# EAGLE schematic Clock_Segment (EAGLE 7.5.0)
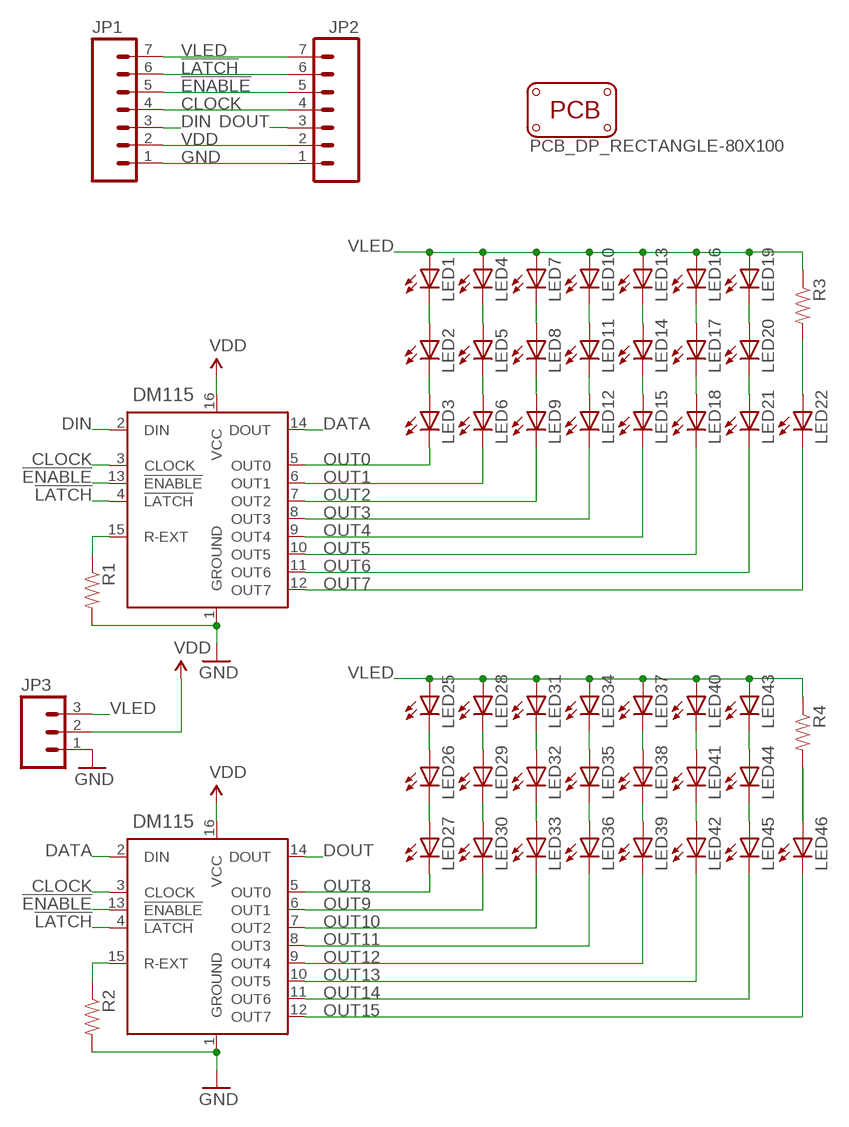
[diagram p0: schematic, sheet 1]

## Parts
JP1  M07  [1X07]
JP2  M07  [1X07]
JP3  M03SCREW  [SCREWTERMINAL-3.5MM-3]
LED1  LEDOVAL  [LED-OVAL]
LED2  LEDOVAL  [LED-OVAL]
LED3  LEDOVAL  [LED-OVAL]
LED4  LEDOVAL  [LED-OVAL]
LED5  LEDOVAL  [LED-OVAL]
LED6  LEDOVAL  [LED-OVAL]
LED7  LEDOVAL  [LED-OVAL]
LED8  LEDOVAL  [LED-OVAL]
LED9  LEDOVAL  [LED-OVAL]
LED10  LEDOVAL  [LED-OVAL]
LED11  LEDOVAL  [LED-OVAL]
LED12  LEDOVAL  [LED-OVAL]
LED13  LEDOVAL  [LED-OVAL]
LED14  LEDOVAL  [LED-OVAL]
LED15  LEDOVAL  [LED-OVAL]
LED16  LEDOVAL  [LED-OVAL]
LED17  LEDOVAL  [LED-OVAL]
LED18  LEDOVAL  [LED-OVAL]
LED19  LEDOVAL  [LED-OVAL]
LED20  LEDOVAL  [LED-OVAL]
LED21  LEDOVAL  [LED-OVAL]
LED22  LEDOVAL  [LED-OVAL]
LED25  LEDOVAL  [LED-OVAL]
LED26  LEDOVAL  [LED-OVAL]
LED27  LEDOVAL  [LED-OVAL]
LED28  LEDOVAL  [LED-OVAL]
LED29  LEDOVAL  [LED-OVAL]
LED30  LEDOVAL  [LED-OVAL]
LED31  LEDOVAL  [LED-OVAL]
LED32  LEDOVAL  [LED-OVAL]
LED33  LEDOVAL  [LED-OVAL]
LED34  LEDOVAL  [LED-OVAL]
LED35  LEDOVAL  [LED-OVAL]
LED36  LEDOVAL  [LED-OVAL]
LED37  LEDOVAL  [LED-OVAL]
LED38  LEDOVAL  [LED-OVAL]
LED39  LEDOVAL  [LED-OVAL]
LED40  LEDOVAL  [LED-OVAL]
LED41  LEDOVAL  [LED-OVAL]
LED42  LEDOVAL  [LED-OVAL]
LED43  LEDOVAL  [LED-OVAL]
LED44  LEDOVAL  [LED-OVAL]
LED45  LEDOVAL  [LED-OVAL]
LED46  LEDOVAL  [LED-OVAL]
PCB1  PCB_DP_RECTANGLE-80X100  [DP10080_V1]
R1  RESISTORAXIAL-0.3  [AXIAL-0.3]
R2  RESISTORAXIAL-0.3  [AXIAL-0.3]
R3  RESISTORAXIAL-0.3  [AXIAL-0.3]
R4  RESISTORAXIAL-0.3  [AXIAL-0.3]
U1  DM115DIP16  [DIL16]
U2  DM115DIP16  [DIL16]

## Nets
!ENABLE: JP1.5 JP2.5 U1.13(!ENABLE) U2.13(!ENABLE)
!LATCH: JP1.6 JP2.6 U1.4(!LATCH) U2.4(!LATCH)
CLOCK: JP1.4 JP2.4 U1.3(CLOCK) U2.3(CLOCK)
DATA: U1.14(DOUT) U2.2(DIN)
DIN: JP1.3 U1.2(DIN)
DOUT: JP2.3 U2.14(DOUT)
GND: JP1.1 JP2.1 JP3.1 R1.P$2 R2.P$2 U1.1(GROUND) U2.1(GROUND)
N$1: R1.P$1 U1.15(R-EXT)
N$2: LED1.CATHODE(C) LED2.ANODE(A)
N$3: LED2.CATHODE(C) LED3.ANODE(A)
N$4: LED4.CATHODE(C) LED5.ANODE(A)
N$5: LED5.CATHODE(C) LED6.ANODE(A)
N$6: LED7.CATHODE(C) LED8.ANODE(A)
N$7: LED8.CATHODE(C) LED9.ANODE(A)
N$8: LED10.CATHODE(C) LED11.ANODE(A)
N$9: LED11.CATHODE(C) LED12.ANODE(A)
N$10: LED13.CATHODE(C) LED14.ANODE(A)
N$11: LED14.CATHODE(C) LED15.ANODE(A)
N$12: LED16.CATHODE(C) LED17.ANODE(A)
N$13: LED17.CATHODE(C) LED18.ANODE(A)
N$14: LED19.CATHODE(C) LED20.ANODE(A)
N$15: LED20.CATHODE(C) LED21.ANODE(A)
N$16: LED46.ANODE(A) R4.P$2
N$18: R2.P$1 U2.15(R-EXT)
N$19: LED25.CATHODE(C) LED26.ANODE(A)
N$20: LED26.CATHODE(C) LED27.ANODE(A)
N$21: LED28.CATHODE(C) LED29.ANODE(A)
N$22: LED29.CATHODE(C) LED30.ANODE(A)
N$23: LED31.CATHODE(C) LED32.ANODE(A)
N$24: LED32.CATHODE(C) LED33.ANODE(A)
N$25: LED34.CATHODE(C) LED35.ANODE(A)
N$26: LED35.CATHODE(C) LED36.ANODE(A)
N$27: LED37.CATHODE(C) LED38.ANODE(A)
N$28: LED38.CATHODE(C) LED39.ANODE(A)
N$29: LED40.CATHODE(C) LED41.ANODE(A)
N$30: LED41.CATHODE(C) LED42.ANODE(A)
N$31: LED43.CATHODE(C) LED44.ANODE(A)
N$32: LED44.CATHODE(C) LED45.ANODE(A)
N$34: LED22.ANODE(A) R3.P$2
OUT0: LED3.CATHODE(C) U1.5(OUT0)
OUT1: LED6.CATHODE(C) U1.6(OUT1)
OUT2: LED9.CATHODE(C) U1.7(OUT2)
OUT3: LED12.CATHODE(C) U1.8(OUT3)
OUT4: LED15.CATHODE(C) U1.9(OUT4)
OUT5: LED18.CATHODE(C) U1.10(OUT5)
OUT6: LED21.CATHODE(C) U1.11(OUT6)
OUT7: LED22.CATHODE(C) U1.12(OUT7)
OUT8: LED27.CATHODE(C) U2.5(OUT0)
OUT9: LED30.CATHODE(C) U2.6(OUT1)
OUT10: LED33.CATHODE(C) U2.7(OUT2)
OUT11: LED36.CATHODE(C) U2.8(OUT3)
OUT12: LED39.CATHODE(C) U2.9(OUT4)
OUT13: LED42.CATHODE(C) U2.10(OUT5)
OUT14: LED45.CATHODE(C) U2.11(OUT6)
OUT15: LED46.CATHODE(C) U2.12(OUT7)
VDD: JP1.2 JP2.2 JP3.2 U1.16(VCC) U2.16(VCC)
VLED: JP1.7 JP2.7 JP3.3 LED1.ANODE(A) LED4.ANODE(A) LED7.ANODE(A) LED10.ANODE(A) LED13.ANODE(A) LED16.ANODE(A) LED19.ANODE(A) LED25.ANODE(A) LED28.ANODE(A) LED31.ANODE(A) LED34.ANODE(A) LED37.ANODE(A) LED40.ANODE(A) LED43.ANODE(A) R3.P$1 R4.P$1

## Library data of the parts
JP1 JP2 = SparkFun-Connectors:M07: Header 7 Standard 7-pin 0.1" header. Use with straight break away headers (SKU : PRT-00116), right angle break away headers (PRT-00553), swiss pins (PRT-00743), machine pins (PRT-00117), and female headers (PRT-00115). NOTES ON THE VARIANTS LOCK and LOCK_LONGPADS... This footprint was designed to help hold the alignment of a through-hole component (i.e. 7-pin header) while soldering it into place. You may notice that each hole has been shifted either up or down by 0.005 of an inch from it's more standard position (which is usually a perfectly straight line). This slight alteration caused the pins (the squares in the middle) to touch the edges of the holes. Because they are alternating, it causes a "brace" to hold the header in place. 0.005 has proven to be the perfect amount of "off-center" position when using our standard breakaway headers. Although looks a little odd when you look at the bare footprint, once you have a header in there, the alteration is very hard to notice. Also, if you push a header all the way into place, it is covered up entirely on the bottom side. This idea of altering the position of holes to aid alignment will be further integrated into the Sparkfun Library for other footprints. It can help hold any component with 3 or more connection pins.
JP3 = SparkFun-Connectors:M03: Header 3 Standard 3-pin 0.1" header. Use with straight break away headers (SKU : PRT-00116), right angle break away headers (PRT-00553), swiss pins (PRT-00743), machine pins (PRT-00117), and female headers (PRT-00115). Molex polarized connector foot print use with SKU : PRT-08232 with associated crimp pins and housings.; PROD_ID: CONN-08288
LED1-LED22 LED25-LED46 = barbary_enterprises:LED: LEDs Standard schematic elements and footprints for 5mm, 3mm, 1206, and 0603 sized LEDs. 5mm - Spark Fun Electronics SKU : COM-00529 (and others)
PCB1 = dp_pcb:PCB_DP_RECTANGLE: Dangerous Prototypes Standard Rectangular PCB sizes
R1-R4 = barbary_enterprises:RESISTOR: Resistor Basic schematic elements and footprints for 0603, 1206, and PTH resistors.
U1 U2 = siti:DM115